# EAGLE design anemix (EAGLE 6.4)
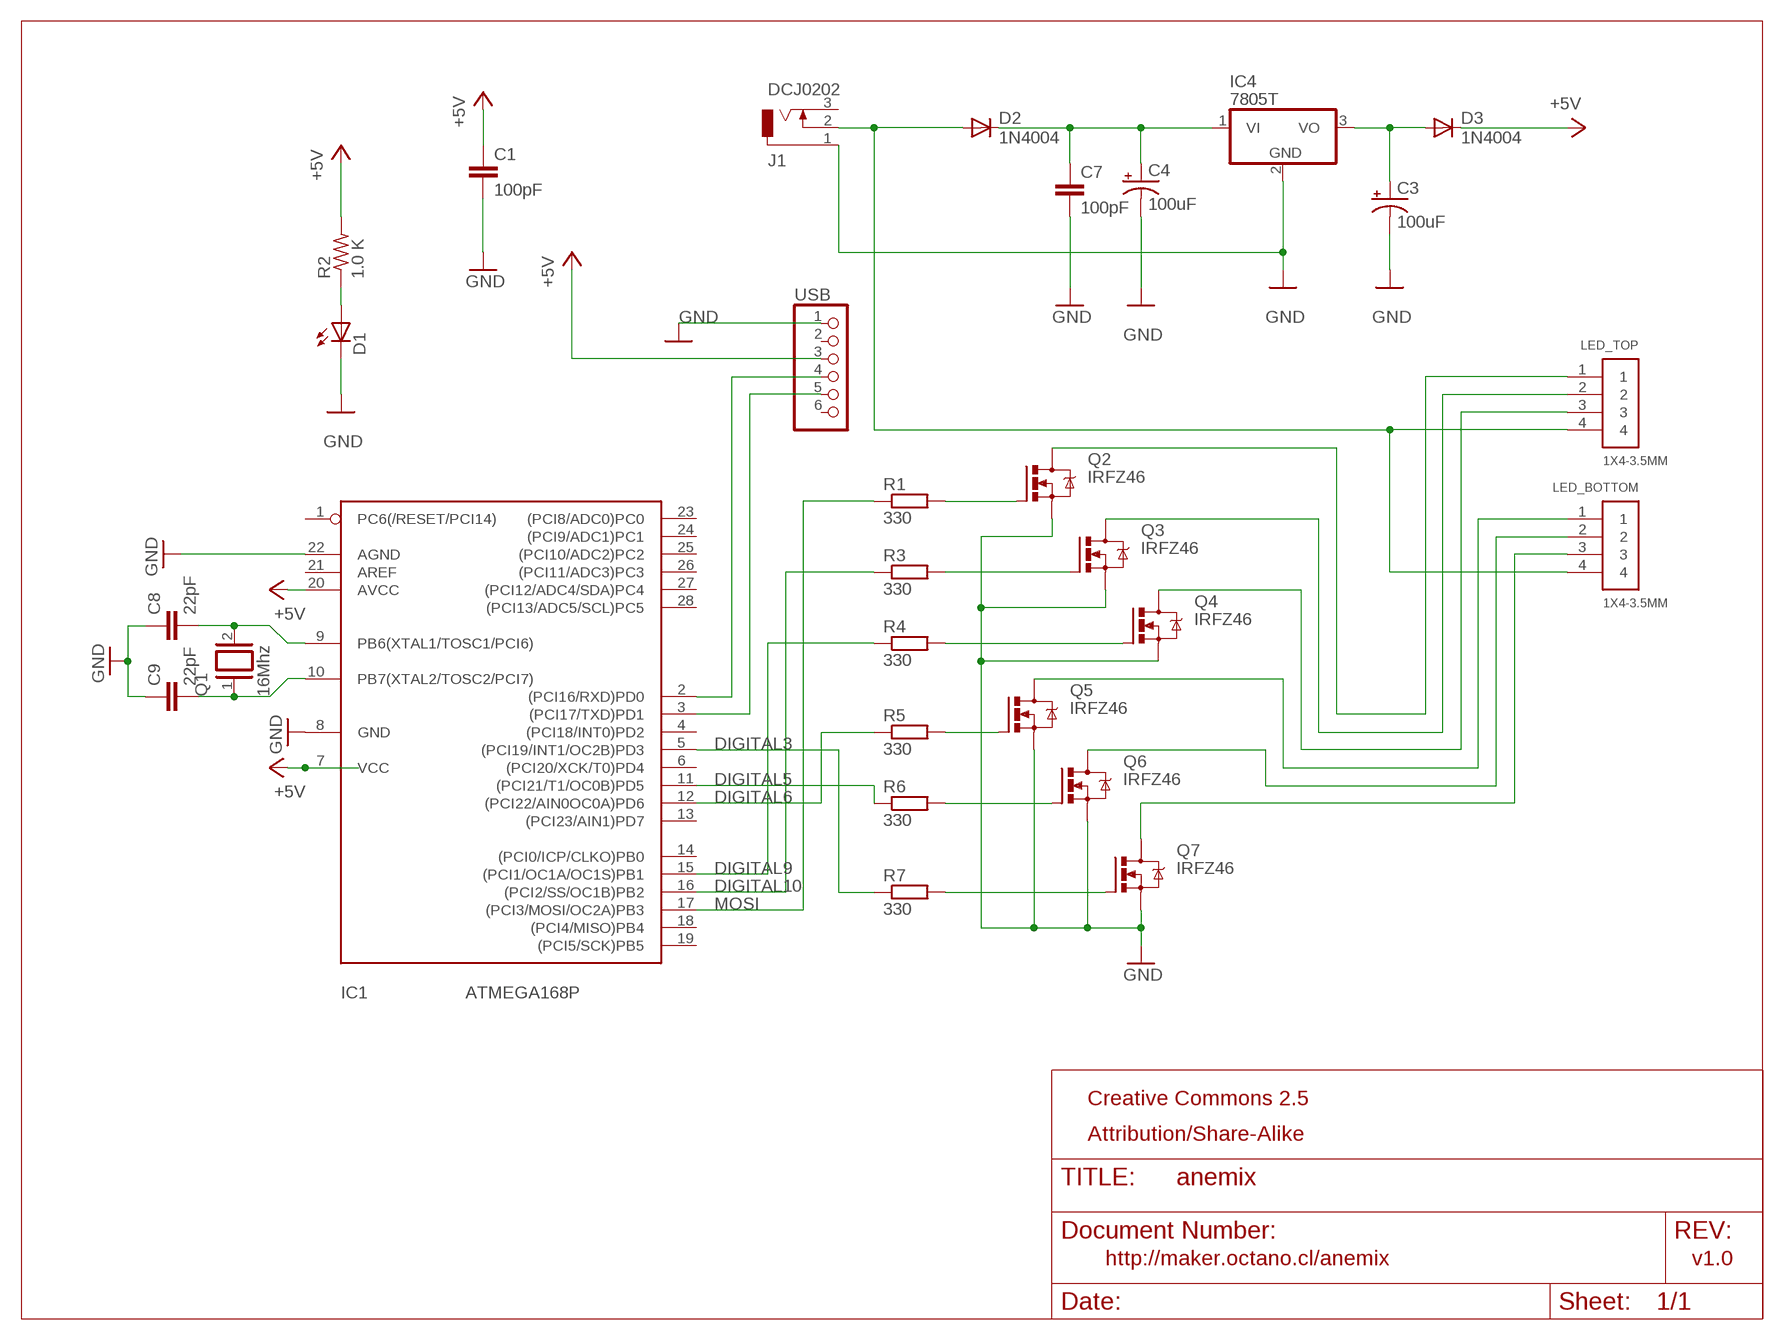
[diagram p0: schematic, sheet 1]

## Parts
C1  100pF  C-EU025-025X050  [C025-025X050]
C3  100uF  CPOL-USE2.5-7  [E2,5-7]
C4  100uF  CPOL-USE2.5-7  [E2,5-7]
C7  100pF  C-EU025-025X050  [C025-025X050]
C8  22pF  C-EU025-025X050  [C025-025X050]
C9  22pF  C-EU025-025X050  [C025-025X050]
D1  LED3MM  [LED3MM]
D2  1N4004  [DO41-10]
D3  1N4004  [DO41-10]
IC1  ATMEGA168P  ATMEGA168PROUND  [DIL28/3]
IC4  7805T  [TO220H]
J1  DCJ0202  [DCJ0202]
LED_BOTTOM  1X4-3.5MM  [1X04-3.5MM]
LED_TOP  1X4-3.5MM  [1X04-3.5MM]
Q1  16Mhz  XTAL/S  [QS]
Q2  IRFZ46  IRFZ48Z  [TO220BH]
Q3  IRFZ46  IRFZ48Z  [TO220BH]
Q4  IRFZ46  IRFZ48Z  [TO220BH]
Q5  IRFZ46  IRFZ48Z  [TO220BH]
Q6  IRFZ46  IRFZ48Z  [TO220BH]
Q7  IRFZ46  IRFZ48Z  [TO220BH]
R1  330  R-EU_0207/10  [0207/10]
R2  1.0 K  R-US_0204/7  [0204/7]
R3  330  R-EU_0207/10  [0207/10]
R4  330  R-EU_0207/10  [0207/10]
R5  330  R-EU_0207/10  [0207/10]
R6  330  R-EU_0207/10  [0207/10]
R7  330  R-EU_0207/10  [0207/10]
USB  PINHD-1X6  [1X06]

## Nets
+5V: C1.1 D3.C IC1.7(VCC) IC1.20(AVCC) R2.2 USB.3
DIGITAL3: IC1.5((PCI19/INT1/OC2B)PD3) R7.1
DIGITAL5: IC1.11((PCI21/T1/OC0B)PD5) R6.1
DIGITAL6: IC1.12((PCI22/AIN0OC0A)PD6) R5.1
DIGITAL9: IC1.15((PCI1/OC1A/OC1S)PB1) R4.1
DIGITAL10: IC1.16((PCI2/SS/OC1B)PB2) R3.1
GND: C1.2 C3.- C4.- C7.2 C8.1 C9.1 D1.K(C) IC1.8(GND) IC1.22(AGND) IC4.2(GND) J1.1 Q2.S Q3.S Q4.S Q5.S Q6.S Q7.S USB.1
MOSI: IC1.17((PCI3/MOSI/OC2A)PB3) R1.1
N$1: C8.2 IC1.9(PB6(XTAL1/TOSC1/PCI6)) Q1.2
N$2: C9.2 IC1.10(PB7(XTAL2/TOSC2/PCI7)) Q1.1
N$3: D1.A R2.1
N$4: IC1.3((PCI17/TXD)PD1) USB.5
N$5: C4.+ C7.1 D2.C IC4.1(VI)
N$6: Q2.G R1.2
N$7: Q3.G R3.2
N$8: Q4.G R4.2
N$9: IC1.2((PCI16/RXD)PD0) USB.4
N$10: Q5.G R5.2
N$11: LED_BOTTOM.1 Q5.D
N$12: LED_BOTTOM.2 Q6.D
N$13: LED_BOTTOM.3 Q7.D
N$14: Q6.G R6.2
N$15: Q7.G R7.2
N$16: D2.A J1.2 LED_BOTTOM.4 LED_TOP.4
N$17: C3.+ D3.A IC4.3(VO)
N$19: LED_TOP.1 Q2.D
N$20: LED_TOP.2 Q3.D
N$21: LED_TOP.3 Q4.D
Unconnected: IC1.1(PC6(/RESET/PCI14)) IC1.4((PCI18/INT0)PD2) IC1.6((PCI20/XCK/T0)PD4) IC1.13((PCI23/AIN1)PD7) IC1.14((PCI0/ICP/CLKO)PB0) IC1.18((PCI4/MISO)PB4) IC1.19((PCI5/SCK)PB5) IC1.21(AREF) IC1.23((PCI8/ADC0)PC0) IC1.24((PCI9/ADC1)PC1) IC1.25((PCI10/ADC2)PC2) IC1.26((PCI11/ADC3)PC3) IC1.27((PCI12/ADC4/SDA)PC4) IC1.28((PCI13/ADC5/SCL)PC5) J1.3 USB.2 USB.6

## Notes on the sheet
- Creative Commons 2.5
- Attribution/Share-Alike
- http://maker.octano.cl/anemix | v1.0

## Library data of the parts
C1 C7-C9 = resistor:C-EU: CAPACITOR, European symbol
C3 C4 = rcl:CPOL-US: POLARIZED CAPACITOR, American symbol
D1 = led:LED: LED OSRAM: - CHIPLED LG R971, LG N971, LY N971, LG Q971, LY Q971, LO R971, LY R971 LH N974, LH R974 LS Q976, LO Q976, LY Q976 LO Q996 - Hyper CHIPLED LW Q18S LB Q993, LB Q99A, LB R99A - SideLED LS A670, LO A670, LY A670, LG A670, LP A670 LB A673, LV A673, LT A673, LW A673 LH A674 LY A675 LS A676, LA A676, LO A676, LY A676, LW A676 LS A679, LY A679, LG A679 - Hyper Micro SIDELED® LS Y876, LA Y876, LO Y876, LY Y876 LT Y87S - SmartLED LW L88C, LW L88S LB L89C, LB L89S, LG L890 LS L89K, LO L89K, LY L89K LS L896, LA L896, LO L896, LY L896 - TOPLED LS T670, LO T670, LY T670, LG T670, LP T670 LSG T670, LSP T670, LSY T670, LOP T670, LYG T670 LG T671, LOG T671, LSG T671 LB T673, LV T673, LT T673, LW T673 LH T674 LS T676, LA T676, LO T676, LY T676, LB T676, LH T676, LSB T676, LW T676 LB T67C, LV T67C, LT T67C, LS T67K, LO T67K, LY T67K, LW E67C LS E67B, LA E67B, LO E67B, LY E67B, LB E67C, LV E67C, LT E67C LW T67C LS T679, LY T679, LG T679 LS T770, LO T770, LY T770, LG T770, LP T770 LB T773, LV T773, LT T773, LW T773 LH T774 LS E675, LA E675, LY E675, LS T675 LS T776, LA T776, LO T776, LY T776, LB T776 LHGB T686 LT T68C, LB T68C - Hyper Mini TOPLED® LB M676 - Mini TOPLED Santana® LG M470 LS M47K, LO M47K, LY M47K Source: http://www.osram.convergy.de LUXEON: - LUMILED® LXK2-PW12-R00, LXK2-PW12-S00, LXK2-PW14-U00, LXK2-PW14-V00 LXK2-PM12-R00, LXK2-PM12-S00, LXK2-PM14-U00 LXK2-PE12-Q00, LXK2-PE12-R00, LXK2-PE12-S00, LXK2-PE14-T00, LXK2-PE14-U00 LXK2-PB12-K00, LXK2-PB12-L00, LXK2-PB12-M00, LXK2-PB14-N00, LXK2-PB14-P00, LXK2-PB14-Q00 LXK2-PR12-L00, LXK2-PR12-M00, LXK2-PR14-Q00, LXK2-PR14-R00 LXK2-PD12-Q00, LXK2-PD12-R00, LXK2-PD12-S00 LXK2-PH12-R00, LXK2-PH12-S00 LXK2-PL12-P00, LXK2-PL12-Q00, LXK2-PL12-R00 Source: www.luxeon.com KINGBRIGHT: KA-3528ASYC Source: www.kingbright.com
D2 D3 = diode:1N4004: DIODE general purpose rectifier, 1 A
IC1 = avr:ATMEGA168*P: MICROCONTROLLER 16 kBytes FLASH 1 kBytes SRAM 512 Bytes EEPROM USART 8-channel 10 bit ADC
IC4 = linear:78*: Positive VOLTAGE REGULATOR Source: http://cache.national.com/ds/LM/LM78L05.pdf http://www.fairchildsemi.com/ds/LM/LM7805.pdf
J1 = con-jack:DCJ0202: DC POWER JACK Source: DCJ0202.pdf; OC_FARNELL: unknown; OC_NEWARK: unknown
LED_BOTTOM LED_TOP = adafruit:1X4: 4-pin connector
Q1 = special:XTAL/S: CRYSTAL
Q2-Q7 = transistor-power:IRFZ48: N Channel HEXFET® Power MOSFET Logic Level Source: http://www.irf.com/product-info/datasheets/data/irfz48z.pdf
R1 R3-R7 = resistor:R-EU_: RESISTOR, European symbol
R2 = resistor:R-US_: RESISTOR, American symbol
USB = adafruit:PINHD-1X6: PIN HEADER

## Board
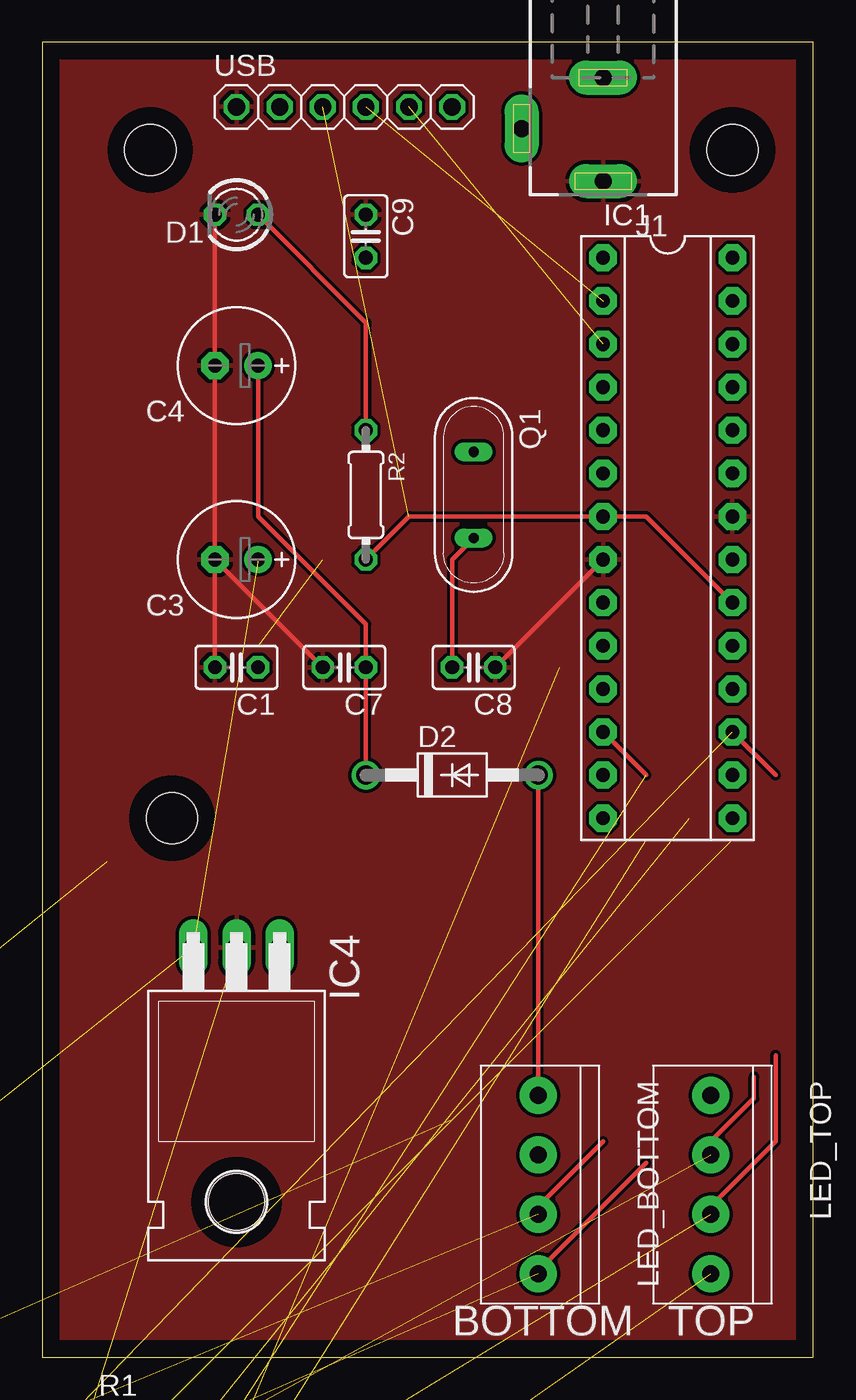
[diagram p1: board, top side]
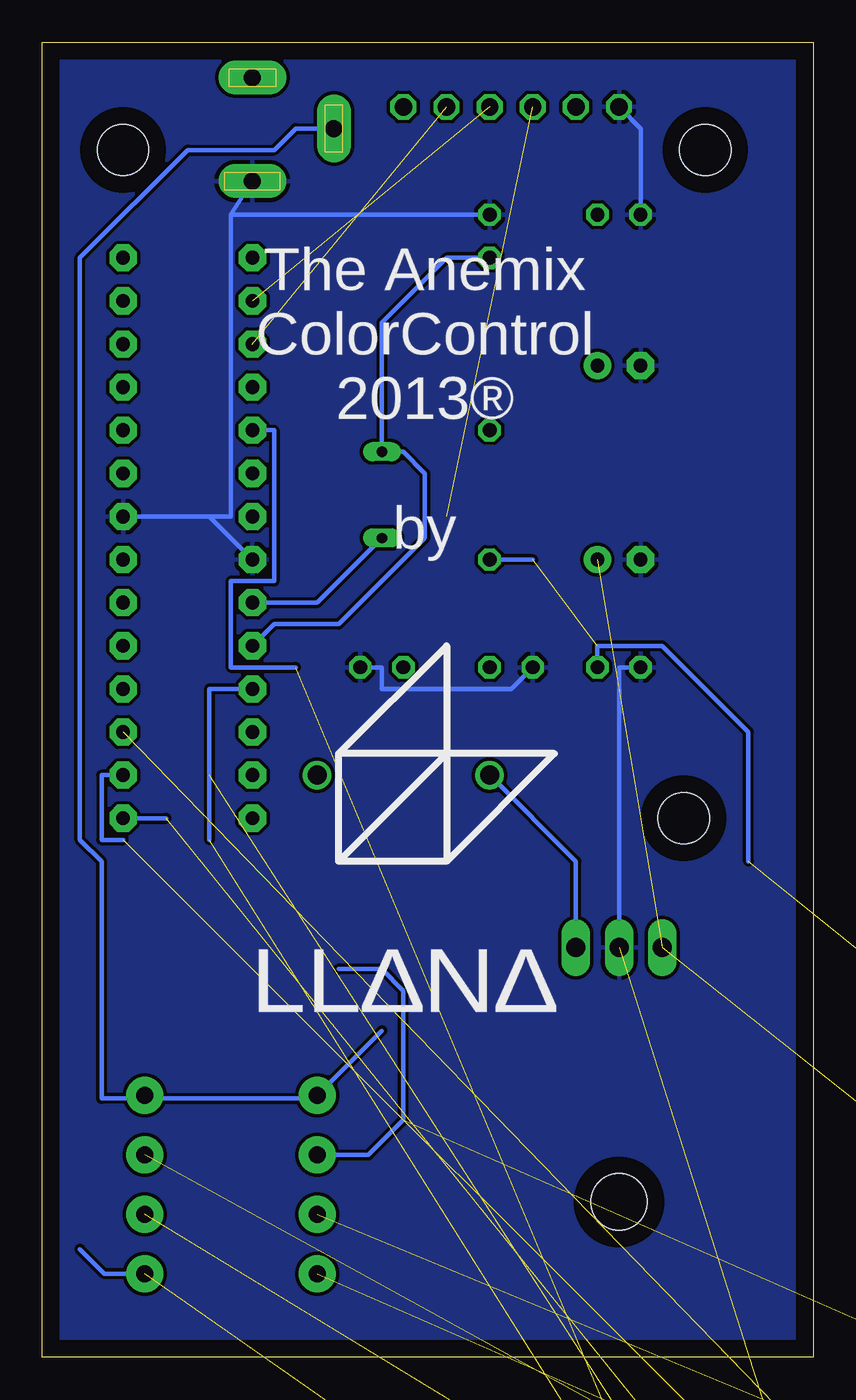
[diagram p2: board, bottom side, seen from below]

Size 45.39 x 77.46 mm. Coordinates in mm from the lower left corner, seen from the top.
Outline: 0,0 45.39,0 45.39,77.46 0,77.46 0,0
Copper layers (1*16): Top 0.035mm / dielectric 1.5mm / Bottom 0.035mm
Design rules "default": minimum track width 10mil, minimum drill 24mil, track to track 8mil, track to pad 8mil, pad to pad 8mil, via to via 8mil, smd to smd 8mil, copper to edge 40mil, drill to drill 8mil, minimum pad ring 10mil, minimum via ring 8mil, stop-mask expansion 4mil, vias tented up to drill 0mil, thermal gap 10mil
Holes 3 mm at 40.64,71.12 6.35,71.12 7.62,31.75

### Footprints (pad centres in the part's own frame; a part is rotated, then mirrored left to right if it is on the bottom)
C025-025X050 = drill 0.813 octagon: 1 -1.27,0; 2 1.27,0
E2,5-7 = drill 0.813 pad 1.6: + -1.27,0 | drill 0.813 pad 1.6 octagon: - 1.27,0
LED3MM = drill 0.813 octagon: A -1.27,0; K 1.27,0
DO41-10 = drill 1.118: A 5.08,0; C -5.08,0
DIL28/3 = drill 0.813 pad 1.6 octagon: 1 -16.51,-3.81; 2 -13.97,-3.81; 3 -11.43,-3.81; 4 -8.89,-3.81; 5 -6.35,-3.81; 6 -3.81,-3.81; 7 -1.27,-3.81; 8 1.27,-3.81; 9 3.81,-3.81; 10 6.35,-3.81; 11 8.89,-3.81; 12 11.43,-3.81; 13 13.97,-3.81; 14 16.51,-3.81; 15 16.51,3.81; 16 13.97,3.81; 17 11.43,3.81; 18 8.89,3.81; 19 6.35,3.81; 20 3.81,3.81; 21 1.27,3.81; 22 -1.27,3.81; 23 -3.81,3.81; 24 -6.35,3.81; 25 -8.89,3.81; 26 -11.43,3.81; 27 -13.97,3.81; 28 -16.51,3.81
TO220H = drill 1.118 long: 1 -2.54,-10.16; 2 0,-10.16; 3 2.54,-10.16 | hole 3.302: 0,4.826
DCJ0202 = drill 1 pad 2 long: 1 0,3.1; 2 4.8,0; 3 0,-3
1X04-3.5MM = drill 1 pad 2.184: 1 -5.25,0; 2 -1.75,0; 3 1.75,0; 4 5.25,0
QS = drill 0.61 long: 1 -2.54,0; 2 2.54,0
TO220BH = drill 1.118 long: D 0,-6.35; G -2.54,-6.35; S 2.54,-6.35 | hole 3.302: 0,11.176
0207/10 = drill 0.813 octagon: 1 -5.08,0; 2 5.08,0
0204/7 = drill 0.813 octagon: 1 -3.81,0; 2 3.81,0
1X06 = drill 1.016 octagon: 1 -6.35,0; 2 -3.81,0; 3 -1.27,0; 4 1.27,0; 5 3.81,0; 6 6.35,0

### Placement (x,y rotation side)
C1  11.43,40.64 180 top
C3  11.43,46.99 180 top
C4  11.43,58.42 180 top
C7  17.78,40.64 180 top
C8  25.4,40.64 180 top
C9  19.05,66.04 270 top
D1  11.43,67.31 180 top
D2  24.13,34.29 0 top
D3  -69.85,-34.29 0 top  (outside the outline)
IC1  36.83,48.26 270 top
IC4  11.43,13.97 180 top
J1  33.02,72.39 180 top
LED_BOTTOM  29.21,10.16 90 top
LED_TOP  39.37,10.16 90 top
Q1  25.4,50.8 270 top
Q2  -7.62,-21.59 0 top  (outside the outline)
Q3  -20.32,-21.59 0 top  (outside the outline)
Q4  -33.02,-21.59 0 top  (outside the outline)
Q5  -45.72,-21.59 0 top  (outside the outline)
Q6  -58.42,-21.59 0 top  (outside the outline)
Q7  -71.12,-21.59 0 top  (outside the outline)
R1  6.35,-3.81 0 top  (outside the outline)
R2  19.05,50.8 270 top
R3  6.35,-8.89 0 top  (outside the outline)
R4  6.35,-13.97 0 top  (outside the outline)
R5  6.35,-19.05 0 top  (outside the outline)
R6  6.35,-24.13 0 top  (outside the outline)
R7  6.35,-29.21 0 top  (outside the outline)
USB  17.78,73.66 0 top

### Tracks (layer width: path | path; a pad name or v marks a point on that pad's centre or on a via)
+5V  (3 unrouted)
  Top 0.254: IC1.20 35.56,49.53 IC1.7 21.59,49.53 R2.2
  Bottom 0.254: C1.1 12.7,41.91 8.89,41.91 3.81,36.83 3.81,29.21 | 16.51,46.99 R2.2
DIGITAL3  (1 unrouted)
  Bottom 0.254: 30.48,40.64 34.29,40.64 34.29,45.72 31.75,45.72 31.75,54.61 IC1.5
DIGITAL5  (1 unrouted)
  Bottom 0.254: 35.56,30.48 35.56,39.37 IC1.11
DIGITAL6  (1 unrouted)
  Top 0.254: IC1.12 35.56,34.29
DIGITAL9  (1 unrouted)
  Bottom 0.254: IC1.15 38.1,31.75
DIGITAL10  (1 unrouted)
  Bottom 0.254: 40.64,30.48 41.91,30.48 41.91,34.29 IC1.16
GND  (6 unrouted)
  Top 0.254: D1.K C4.- C3.- | C3.- C1.2 | C3.- C7.2 | C8.1 IC1.8
  Bottom 0.254: IC4.2 11.43,40.64 C1.2 | 35.56,49.53 IC1.8 | IC1.22 35.56,49.53 | C8.1 25.4,40.64 25.4,39.37 17.78,39.37 C7.2 | 34.29,67.31 34.29,49.53 35.56,49.53 | 34.29,67.31 J1.1 | D1.K 10.16,72.39 USB.1 | C9.1 34.29,67.31
  pour Top: 0,77.47 45.72,77.47 45.72,0 0,0
  pour Bottom: 0,77.47 45.72,77.47 45.72,0 0,0
MOSI  (1 unrouted)
  Top 0.254: IC1.17 43.18,34.29
N$1
  Top 0.254: C8.2 24.13,46.99 Q1.2
  Bottom 0.254: Q1.2 29.21,44.45 IC1.9
N$2
  Bottom 0.254: IC1.10 31.75,43.18 27.94,43.18 22.86,48.26 22.86,52.07 24.13,53.34 Q1.1 25.4,60.96 21.59,64.77 C9.2
N$3
  Top 0.254: R2.1 19.05,60.96 D1.A
N$4  (1 unrouted)
N$5
  Top 0.254: D2.C C7.1 19.05,43.18 12.7,49.53 C4.+
  Bottom 0.254: IC4.1 13.97,29.21 D2.C
N$6  (1 unrouted)
N$7  (1 unrouted)
N$8  (1 unrouted)
N$9  (1 unrouted)
N$10  (1 unrouted)
N$11  (1 unrouted)
  Top 0.254: 35.56,11.43 29.21,5.08 LED_BOTTOM.1
N$12  (1 unrouted)
  Top 0.254: 33.02,12.7 29.21,8.89 LED_BOTTOM.2
N$13  (1 unrouted)
  Bottom 0.254: 27.94,22.86 25.4,22.86 24.13,21.59 24.13,13.97 26.19,11.91 LED_BOTTOM.3
N$14  (1 unrouted)
N$15  (1 unrouted)
N$16
  Top 0.254: D2.A LED_BOTTOM.4 29.21,15.24
  Bottom 0.254: 39.37,15.24 41.91,15.24 41.91,29.21 43.18,30.48 43.18,64.77 36.83,71.12 31.75,71.12 30.48,72.39 J1.2 | 39.37,15.24 29.21,15.24 LED_BOTTOM.4 25.4,19.22 | 39.37,15.24 LED_TOP.4
N$17  (2 unrouted)
N$19  (1 unrouted)
  Bottom 0.254: LED_TOP.1 41.74,4.91 43.18,6.35
N$20  (1 unrouted)
  Top 0.254: 43.18,17.78 43.18,12.7 39.37,8.89 LED_TOP.2
N$21  (1 unrouted)
  Top 0.254: 41.91,16.51 41.91,15.24 39.37,12.7 LED_TOP.3

### Text on the board
tPlace: BOTTOM | TOP
bPlace: The Anemix / ColorControl / 2013® / / by | LL∆N∆